# EAGLE design ARK (EAGLE 9.4.2)
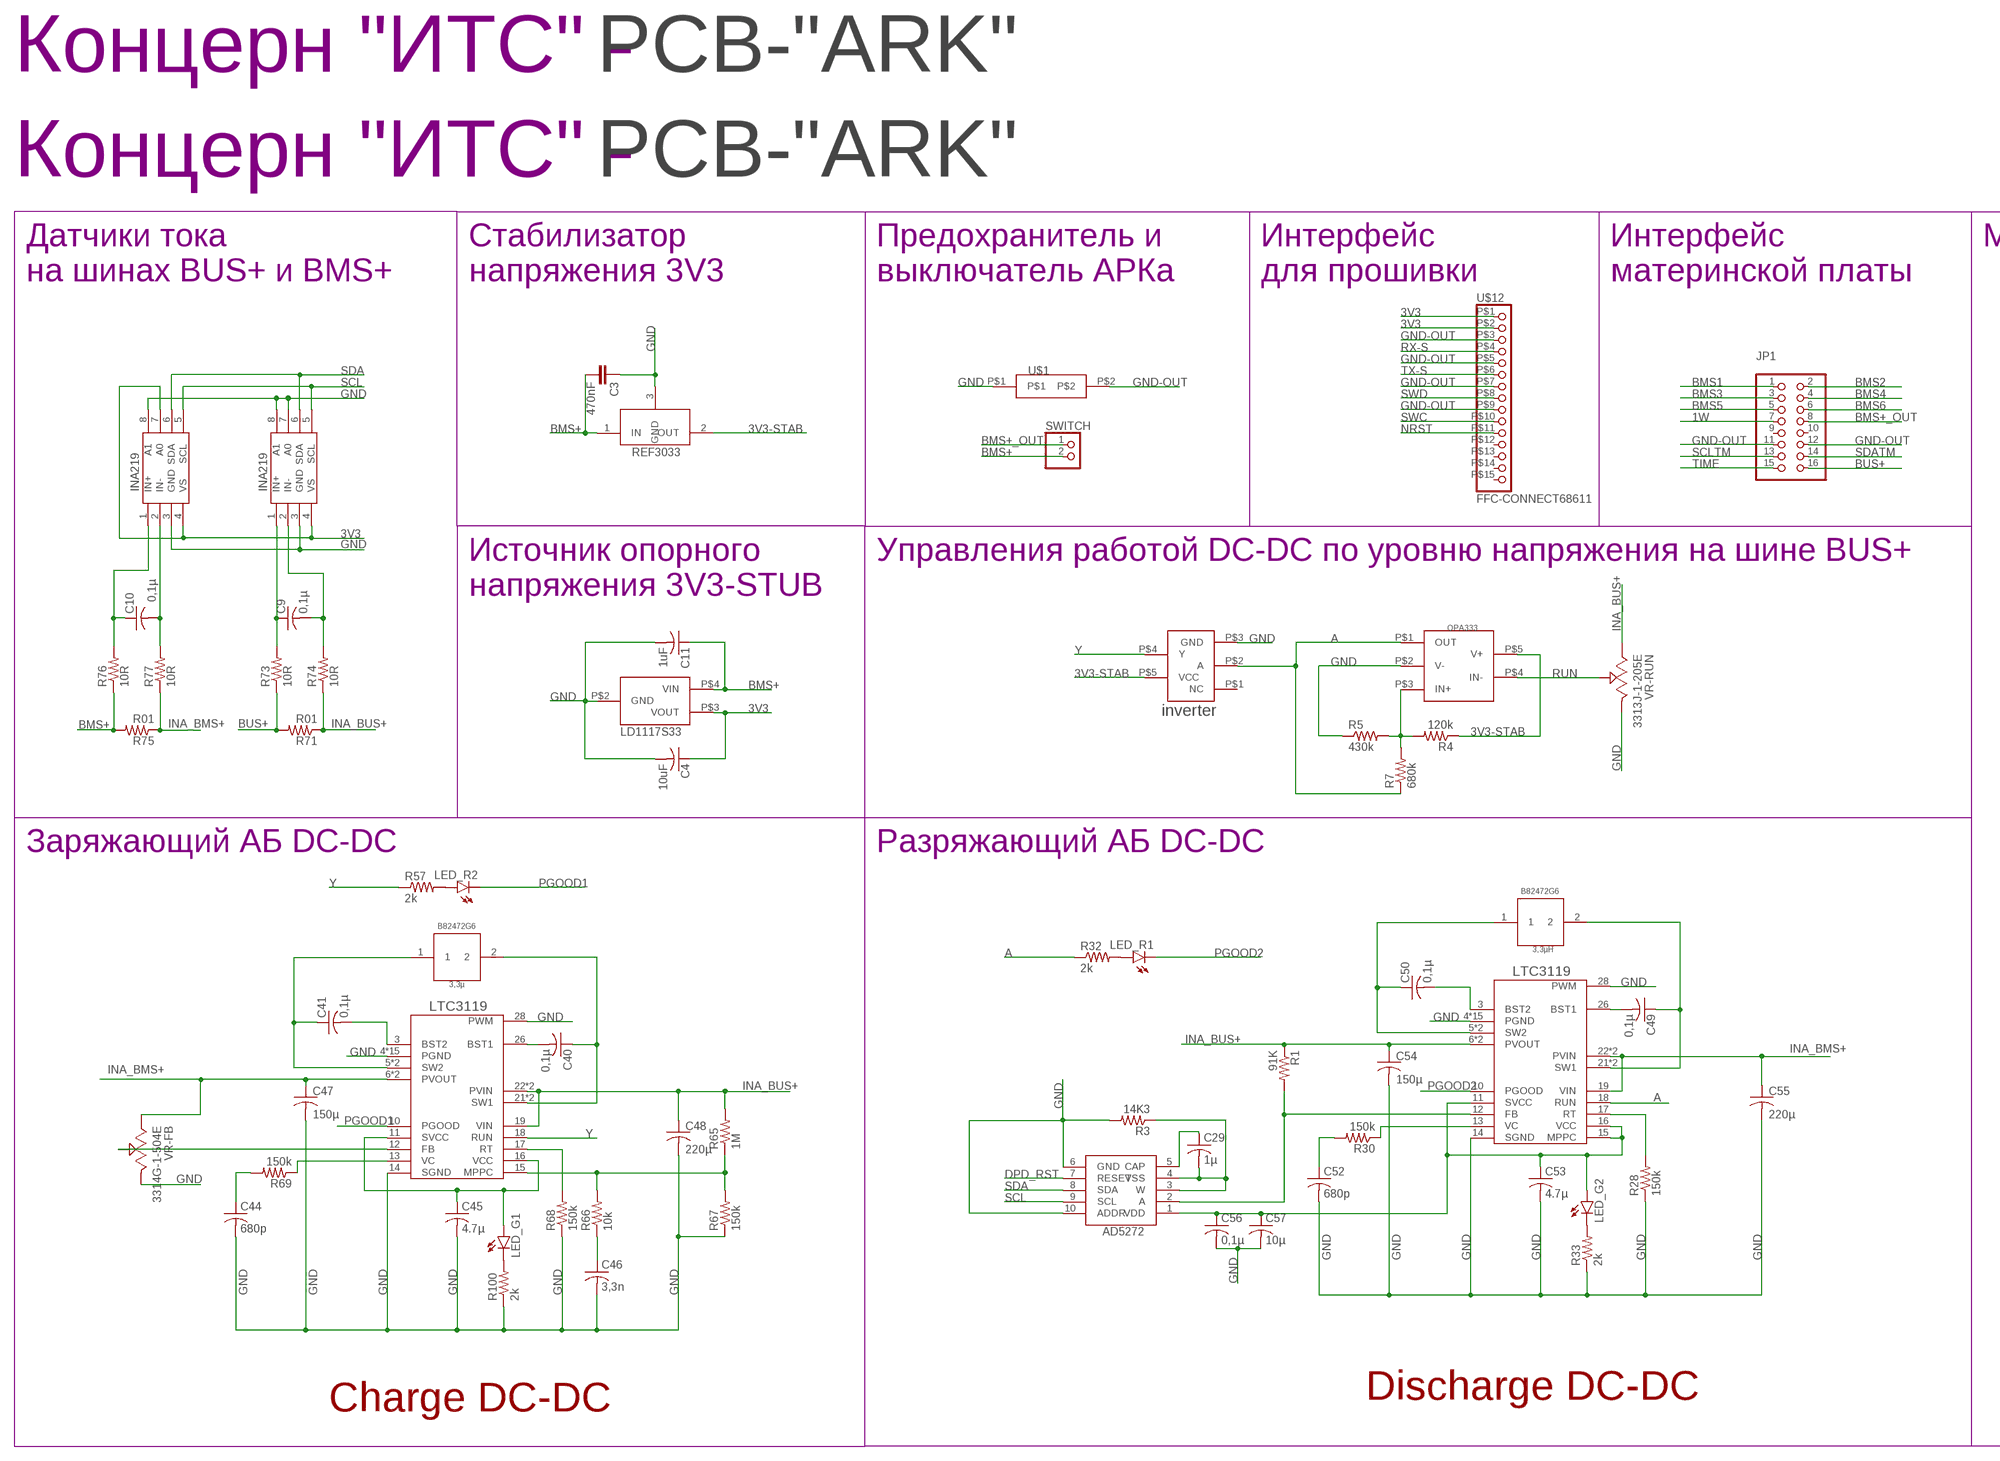
[diagram p0: schematic, sheet 1, part 1 of 2]
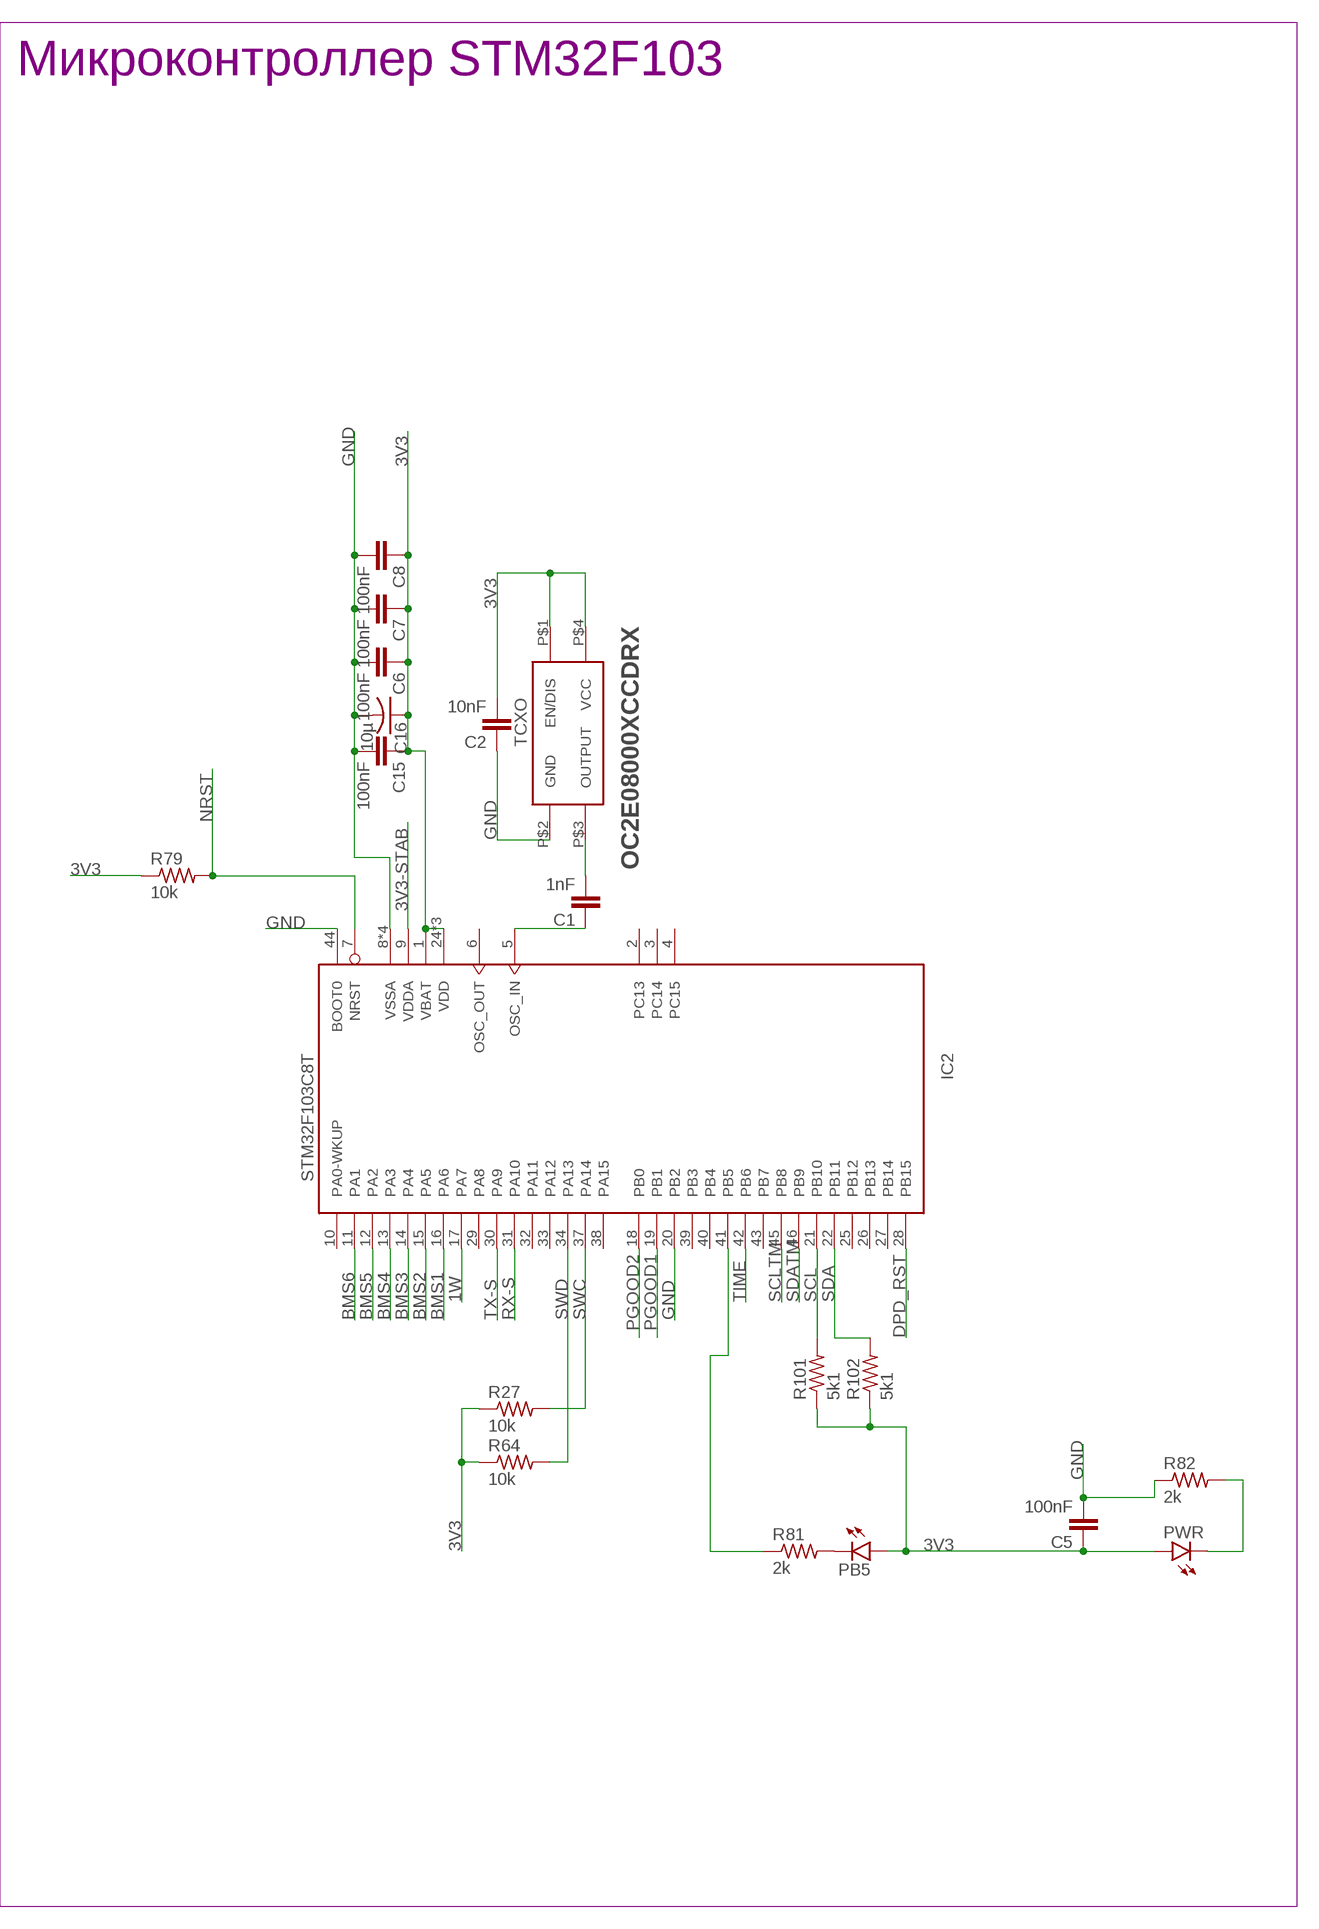
[diagram p1: schematic, sheet 1, part 2 of 2]

## Parts
3,3µH  3,3µ  B82472G6  [B82472G6]
3,3µH1  3,3µH  B82472G6  [B82472G6]
AD5272#2  AD5272  [MSOP10]
C1  1nF  C-EUC0603  [C0603]
C2  10nF  C-EUC0603  [C0603]
C3  470nF  C-EUC0603  [C0603]
C4  10uF  ECAP1UF  [ECAP-SMD-D4]
C5  100nF  C-EUC0603  [C0603]
C6  100nF  C-EUC0603  [C0603]
C7  100nF  C-EUC0603  [C0603]
C8  100nF  C-EUC0603  [C0603]
C9  0,1µ  C-USC0603  [C0603]
C10  0,1µ  C-USC0603  [C0603]
C11  1uF  ECAP1UF  [ECAP-SMD-D4]
C15  100nF  C-EUC0603  [C0603]
C16  10µ  C-USC1206  [C1206]
C29  1µ  C-USC0603  [C0603]
C40  0,1µ  C-USC0603  [C0603]
C41  0,1µ  C-USC0603  [C0603]
C44  680p  C-USC0603  [C0603]
C45  4.7µ  C-USC1206  [C1206]
C46  3,3n  C-USC0603  [C0603]
C47  150µ  ECAPECAP150  [ECAP150-CMD]
C48  220µ  ECAPECAP220  [ECAP220-CMD]
C49  0,1µ  C-USC0603  [C0603]
C50  0,1µ  C-USC0603  [C0603]
C52  680p  C-USC0603  [C0603]
C53  4.7µ  C-USC1206  [C1206]
C54  150µ  ECAPECAP150  [ECAP150-CMD]
C55  220µ  ECAPECAP220  [ECAP220-CMD]
C56  0,1µ  C-USC0603  [C0603]
C57  10µ  C-USC1206  [C1206]
IC2  STM32F103C8T  [LQFP48]
INA219#1  INA219AID  [SOT23-8]
INA219#2  INA219AID  [SOT23-8]
INVERT  INVERTER.  [SC70]
JP1  PINHD-2X8  [2X08]
LD1117S33  LD1117S33  [SOT223]
LED_G1  LEDCHIPLED_0603  [CHIPLED_0603]
LED_G2  LEDCHIPLED_0603  [CHIPLED_0603]
LED_R1  LEDCHIPLED_0603  [CHIPLED_0603]
LED_R2  LEDCHIPLED_0603  [CHIPLED_0603]
OPA  OPA333  [SOT23-5]
PB5  LEDCHIPLED_0603  [CHIPLED_0603]
PWR  LEDCHIPLED_0603  [CHIPLED_0603]
R1  91K  R-US_R0603  [R0603]
R3  14K3  R-US_R0603  [R0603]
R4  120k  R-US_R0603  [R0603]
R5  430k  R-US_R0603  [R0603]
R7  680k  R-US_R0603  [R0603]
R27  10k  R-US_R0603  [R0603]
R28  150k  R-US_R0603  [R0603]
R30  150k  R-US_R0603  [R0603]
R32  2k  R-US_R0603  [R0603]
R33  2k  R-US_R0603  [R0603]
R57  2k  R-US_R0603  [R0603]
R64  10k  R-US_R0603  [R0603]
R65  1M  R-US_R0603  [R0603]
R66  10k  R-US_R0603  [R0603]
R67  150k  R-US_R0603  [R0603]
R68  150k  R-US_R0603  [R0603]
R69  150k  R-US_R0603  [R0603]
R71  R01  R-US_R2512  [R2512]
R73  10R  R-US_R0603  [R0603]
R74  10R  R-US_R0603  [R0603]
R75  R01  R-US_R2512  [R2512]
R76  10R  R-US_R0603  [R0603]
R77  10R  R-US_R0603  [R0603]
R79  10k  R-US_R0603  [R0603]
R81  2k  R-US_R0603  [R0603]
R82  2k  R-US_R0603  [R0603]
R100  2k  R-US_R0603  [R0603]
R101  5k1  R-US_R0603  [R0603]
R102  5k1  R-US_R0603  [R0603]
REF3033  REF3033  [SOT23-3]
SWITCH  PINHD-1X2  [1X02]
TCXO  OC2E08000XCCDRX  [OC2E08000XCCDRX]
U$1  MF-R400  [MF-R400]
U$3  PCB-"ARK"  ITS-LOGOPCB-""  [ITS-LOGO]
U$4  PCB-"ARK"  ITS-LOGOPCB-""  [ITS-LOGO]
U$12  FFC-CONNECT68611  [68611]
U$23  LTC31191  [LTC3119+VIA]
U$59  LTC31191  [LTC3119+VIA]
VR-FB  3314G-1-504E  [TRIM_3314G-1-504E]
VR-RUN  3313J-1-205E  [TRIM_3313J-1-205E]

## Nets
1W: IC2.17(PA7) JP1.7
3V3: C2.2 C4.P+ C5.1 C6.1 C7.1 C8.1 C15.1 C16.1 IC2.1(VBAT) IC2.24(VDD) IC2.36(VDD) IC2.48(VDD) INA219#1.4(VS) INA219#2.4(VS) INA219#2.7(A0) LD1117S33.P$3(VOUT) PB5.A PWR.A R27.1 R64.1 R79.1 R101.1 R102.1 TCXO.P$1(EN/DIS) TCXO.P$4(VCC) U$12.P$1 U$12.P$2
3V3-STAB: IC2.9(VDDA) INVERT.P$5(VCC) OPA.P$5(V+) R4.1 REF3033.2(OUT)
90: R65.1 R66.2 R67.2 U$59.15(MPPC)
A: INVERT.P$2(A) OPA.P$1(OUT) R7.1 R32.1 U$23.18(RUN)
BMS1: IC2.16(PA6) JP1.1
BMS2: IC2.15(PA5) JP1.2
BMS3: IC2.14(PA4) JP1.3
BMS4: IC2.13(PA3) JP1.4
BMS5: IC2.12(PA2) JP1.5
BMS6: IC2.11(PA1) JP1.6
BMS+: C3.2 C11.P+ LD1117S33.P$4(VIN) R75.2 R76.1 REF3033.1(IN) SWITCH.2
BMS+_OUT: JP1.8 SWITCH.1
BUS+: JP1.16 R71.2 R73.1
DPD_RST: AD5272#2.7(RESET) IC2.28(PB15)
GND: AD5272#2.6(GND) AD5272#2.10(ADDR) C2.1 C3.1 C4.P- C5.2 C6.2 C7.2 C8.2 C11.P- C15.2 C16.2 C44.2 C45.2 C46.2 C47.P$2 C48.P$2 C52.2 C53.2 C54.P$2 C55.P$2 C56.2 C57.2 IC2.8(VSSA) IC2.20(PB2) IC2.23(VSSA) IC2.35(VSSA) IC2.44(BOOT0) IC2.47(VSSA) INA219#1.3(GND) INA219#1.7(A0) INA219#1.8(A1) INA219#2.3(GND) INA219#2.8(A1) INVERT.P$3(GND) LD1117S33.P$2(GND) OPA.P$2(V-) R3.2 R5.1 R28.1 R33.1 R67.1 R68.1 R82.1 R100.1 REF3033.3(GND) TCXO.P$2(GND) U$1.P$1 U$23.4(PGND) U$23.9(PGND) U$23.14(SGND) U$23.20(PGND) U$23.25(PGND) U$23.28(PWM) U$23.29(PGND) U$23.P$1(PGND) U$23.P$2(PGND) U$23.P$3(PGND) U$23.P$4(PGND) U$23.P$5(PGND) U$23.P$6(PGND) U$23.P$7(PGND) U$23.P$8(PGND) U$23.P$9(PGND) U$23.P$10(PGND) U$59.4(PGND) U$59.9(PGND) U$59.14(SGND) U$59.20(PGND) U$59.25(PGND) U$59.28(PWM) U$59.29(PGND) U$59.P$1(PGND) U$59.P$2(PGND) U$59.P$3(PGND) U$59.P$4(PGND) U$59.P$5(PGND) U$59.P$6(PGND) U$59.P$7(PGND) U$59.P$8(PGND) U$59.P$9(PGND) U$59.P$10(PGND) VR-FB.3(CW) VR-RUN.3(CW)
GND-OUT: JP1.11 JP1.12 U$1.P$2 U$12.P$3 U$12.P$5 U$12.P$7 U$12.P$9
INA_BMS+: C47.P$1 C55.P$1 R75.1 R77.1 U$23.19(VIN) U$23.22(PVIN) U$23.23(PVIN) U$59.6(PVOUT) U$59.7(PVOUT) VR-FB.1(CCW)
INA_BUS+: C48.P$1 C54.P$1 R1.1 R65.2 R71.1 R74.1 U$23.6(PVOUT) U$23.7(PVOUT) U$59.19(VIN) U$59.22(PVIN) U$59.23(PVIN) VR-RUN.1(CCW)
N$1: C1.1 IC2.5(OSC_IN)
N$2: OPA.P$3(IN+) R4.2 R5.2 R7.2
N$3: AD5272#2.2(A) R1.2 U$23.12(FB)
N$4: C1.2 TCXO.P$3(OUTPUT)
N$14: C9.2 INA219#1.2(IN-) R74.2
N$17: PB5.C R81.2
N$48: AD5272#2.3(W) AD5272#2.4(VSS) C29.2 R3.1
N$51: AD5272#2.5(CAP) C29.1
N$77: 3,3µH1.2 C49.1 U$23.21(SW1) U$23.24(SW1)
N$78: 3,3µH1.1 C50.1 U$23.5(SW2) U$23.8(SW2)
N$79: R28.2 U$23.17(RT)
N$80: C49.2 U$23.26(BST1)
N$81: R30.1 U$23.13(VC)
N$82: C52.1 R30.2
N$84: C50.2 U$23.3(BST2)
N$85: LED_R1.A R32.2
N$87: LED_R2.A R57.2
N$89: U$59.12(FB) VR-FB.2(WIPER)
N$91: LED_G1.C R100.2
N$92: LED_G2.C R33.2
N$129: C41.2 U$59.3(BST2)
N$131: 3,3µH.2 C40.1 U$59.21(SW1) U$59.24(SW1)
N$132: 3,3µH.1 C41.1 U$59.5(SW2) U$59.8(SW2)
N$135: R69.1 U$59.13(VC)
N$136: C44.1 R69.2
N$139: C46.1 R66.1
N$142: R68.2 U$59.17(RT)
N$144: C40.2 U$59.26(BST1)
N$147: C9.1 INA219#1.1(IN+) R73.2
N$150: C10.1 INA219#2.1(IN+) R76.2
N$151: C10.2 INA219#2.2(IN-) R77.2
N$159: PWR.C R82.2
N$161: IC2.41(PB5) R81.1
N$215: AD5272#2.1(VDD) C53.1 C56.1 C57.1 LED_G2.A U$23.11(SVCC) U$23.15(MPPC) U$23.16(VCC)
N$234: C45.1 LED_G1.A U$59.11(SVCC) U$59.16(VCC)
NRST: IC2.7(NRST) R79.2 U$12.P$11
PGOOD1: IC2.19(PB1) LED_R2.C U$59.10(PGOOD)
PGOOD2: IC2.18(PB0) LED_R1.C U$23.10(PGOOD)
RUN: OPA.P$4(IN-) VR-RUN.2(WIPER)
RX-S: IC2.31(PA10) U$12.P$4
SCL: AD5272#2.9(SCL) IC2.21(PB10) INA219#1.5(SCL) INA219#2.5(SCL) R101.2
SCLTM: IC2.45(PB8) JP1.13
SDA: AD5272#2.8(SDA) IC2.22(PB11) INA219#1.6(SDA) INA219#2.6(SDA) R102.2
SDATM: IC2.46(PB9) JP1.14
SWC: IC2.37(PA14) R27.2 U$12.P$10
SWD: IC2.34(PA13) R64.2 U$12.P$8
TIME: IC2.42(PB6) JP1.15
TX-S: IC2.30(PA9) U$12.P$6
Y: INVERT.P$4(Y) R57.1 U$59.18(RUN)
Unconnected: IC2.2(PC13) IC2.3(PC14) IC2.4(PC15) IC2.6(OSC_OUT) IC2.10(PA0-WKUP) IC2.25(PB12) IC2.26(PB13) IC2.27(PB14) IC2.29(PA8) IC2.32(PA11) IC2.33(PA12) IC2.38(PA15) IC2.39(PB3) IC2.40(PB4) IC2.43(PB7) INVERT.P$1(NC) JP1.9 JP1.10 U$12.P$12 U$12.P$13 U$12.P$14 U$12.P$15

## Notes on the sheet
- Датчики тока
  на шинах BUS+ и BMS+
- Стабилизатор
  напряжения 3V3
- Предохранитель и
  выключатель АРКа
- Интерфейс
  для прошивки
- Интерфейс
  материнской платы
- Микроконтроллер STM32F103
- Источник опорного
  напряжения 3V3-STUB
- Управления работой DC-DC по уровню напряжения на шине BUS+
- Заряжающий АБ DC-DC | Разряжающий АБ DC-DC
- Charge DC-DC | Discharge DC-DC

## Library data of the parts
3,3µH 3,3µH1 = CanCubeSat:B82472G6
AD5272#2 = CanCubeSat:AD5272
C1-C3 C5-C8 C15 = rcl:C-EU: CAPACITOR, European symbol; SPICEPREFIX: C
C4 C11 C47 C48 C54 C55 = CanCubeSat:ECAP
C9 C10 C16 C29 C40 C41 C44-C46 C49 C50 C52 C53 C56 C57 = rcl:C-US: CAPACITOR, American symbol; SPICEPREFIX: C
IC2 = CanCubeSat:STM32F103C*T: ARM 32-bit Cortex™-M3 CPU 72 MHz maximum frequency 16 to 128 Kbytes of Flash memory 6 to 20 kbytes of SRAM 37 GPIOs 2.0 to 3.6 V application supply
INA219#1 INA219#2 = CanCubeSat:INA219AID
INVERT = CanCubeSat:INVERTER
JP1 = pinheadCS:PINHD-2X8: PIN HEADER
LD1117S33 = CanCubeSat:LD1117S33
LED_G1 LED_G2 LED_R1 LED_R2 PB5 PWR = led:LED: LED OSRAM: - CHIPLED LG R971, LG N971, LY N971, LG Q971, LY Q971, LO R971, LY R971 LH N974, LH R974 LS Q976, LO Q976, LY Q976 LO Q996 - Hyper CHIPLED LW Q18S LB Q993, LB Q99A, LB R99A - SideLED LS A670, LO A670, LY A670, LG A670, LP A670 LB A673, LV A673, LT A673, LW A673 LH A674 LY A675 LS A676, LA A676, LO A676, LY A676, LW A676 LS A679, LY A679, LG A679 - Hyper Micro SIDELED® LS Y876, LA Y876, LO Y876, LY Y876 LT Y87S - SmartLED LW L88C, LW L88S LB L89C, LB L89S, LG L890 LS L89K, LO L89K, LY L89K LS L896, LA L896, LO L896, LY L896 - TOPLED LS T670, LO T670, LY T670, LG T670, LP T670 LSG T670, LSP T670, LSY T670, LOP T670, LYG T670 LG T671, LOG T671, LSG T671 LB T673, LV T673, LT T673, LW T673 LH T674 LS T676, LA T676, LO T676, LY T676, LB T676, LH T676, LSB T676, LW T676 LB T67C, LV T67C, LT T67C, LS T67K, LO T67K, LY T67K, LW E67C LS E67B, LA E67B, LO E67B, LY E67B, LB E67C, LV E67C, LT E67C LW T67C LS T679, LY T679, LG T679 LS T770, LO T770, LY T770, LG T770, LP T770 LB T773, LV T773, LT T773, LW T773 LH T774 LS E675, LA E675, LY E675, LS T675 LS T776, LA T776, LO T776, LY T776, LB T776 LHGB T686 LT T68C, LB T68C - Hyper Mini TOPLED® LB M676 - Mini TOPLED Santana® LG M470 LS M47K, LO M47K, LY M47K Source: http://www.osram.convergy.de LUXEON: - LUMILED® LXK2-PW12-R00, LXK2-PW12-S00, LXK2-PW14-U00, LXK2-PW14-V00 LXK2-PM12-R00, LXK2-PM12-S00, LXK2-PM14-U00 LXK2-PE12-Q00, LXK2-PE12-R00, LXK2-PE12-S00, LXK2-PE14-T00, LXK2-PE14-U00 LXK2-PB12-K00, LXK2-PB12-L00, LXK2-PB12-M00, LXK2-PB14-N00, LXK2-PB14-P00, LXK2-PB14-Q00 LXK2-PR12-L00, LXK2-PR12-M00, LXK2-PR14-Q00, LXK2-PR14-R00 LXK2-PD12-Q00, LXK2-PD12-R00, LXK2-PD12-S00 LXK2-PH12-R00, LXK2-PH12-S00 LXK2-PL12-P00, LXK2-PL12-Q00, LXK2-PL12-R00 Source: www.luxeon.com KINGBRIGHT: KA-3528ASYC Source: www.kingbright.com
OPA = CanCubeSat:OPA333
R1 R3-R5 R7 R27 R28 R30 R32 R33 R57 R64-R69 R73 R74 R76 R77 R79 R81 R82 R100-R102 = resistor:R-US_: RESISTOR, American symbol
R71 R75 = rcl:R-US_: RESISTOR, American symbol; SPICEPREFIX: R
REF3033 = CanCubeSat:REF3033
SWITCH = pinheadCS:PINHD-1X2: PIN HEADER
TCXO = CanCubeSat:OC2E08000XCCDRX: TCXO OC2E08000XCCDRX 8 MHz
U$1 = CanCubeSat:MF-R400
U$3 U$4 = CanCubeSat:ITS-LOGO
U$12 = CanCubeSat:FFC-CONNECT
U$23 U$59 = CanCubeSat:LTC3119
VR-FB = CanCubeSat:3314G-1-504E
VR-RUN = CanCubeSat:3313J-1-205E: 200 kOhms 0.125W, 1/8W J Lead Surface Mount Trimmer Potentiometer Cermet 1 Turn Top Adjustment Check prices <https://pricing.snapeda.com/parts/3313J-1-104E/Bourns/view-part?ref=eda>; AVAILABILITY: Good; DESCRIPTION: 100 kOhms 0.125W, 1/8W J Lead Surface Mount Trimmer Potentiometer Cermet 1 Turn Top Adjustment; MF: Bourns; MP: 3313J-1-104E; PACKAGE: 5025 Bourns; PRICE: None; PURCHASE-URL: https://pricing.snapeda.com/search/part/3313J-1-104E/?ref=eda

## Board
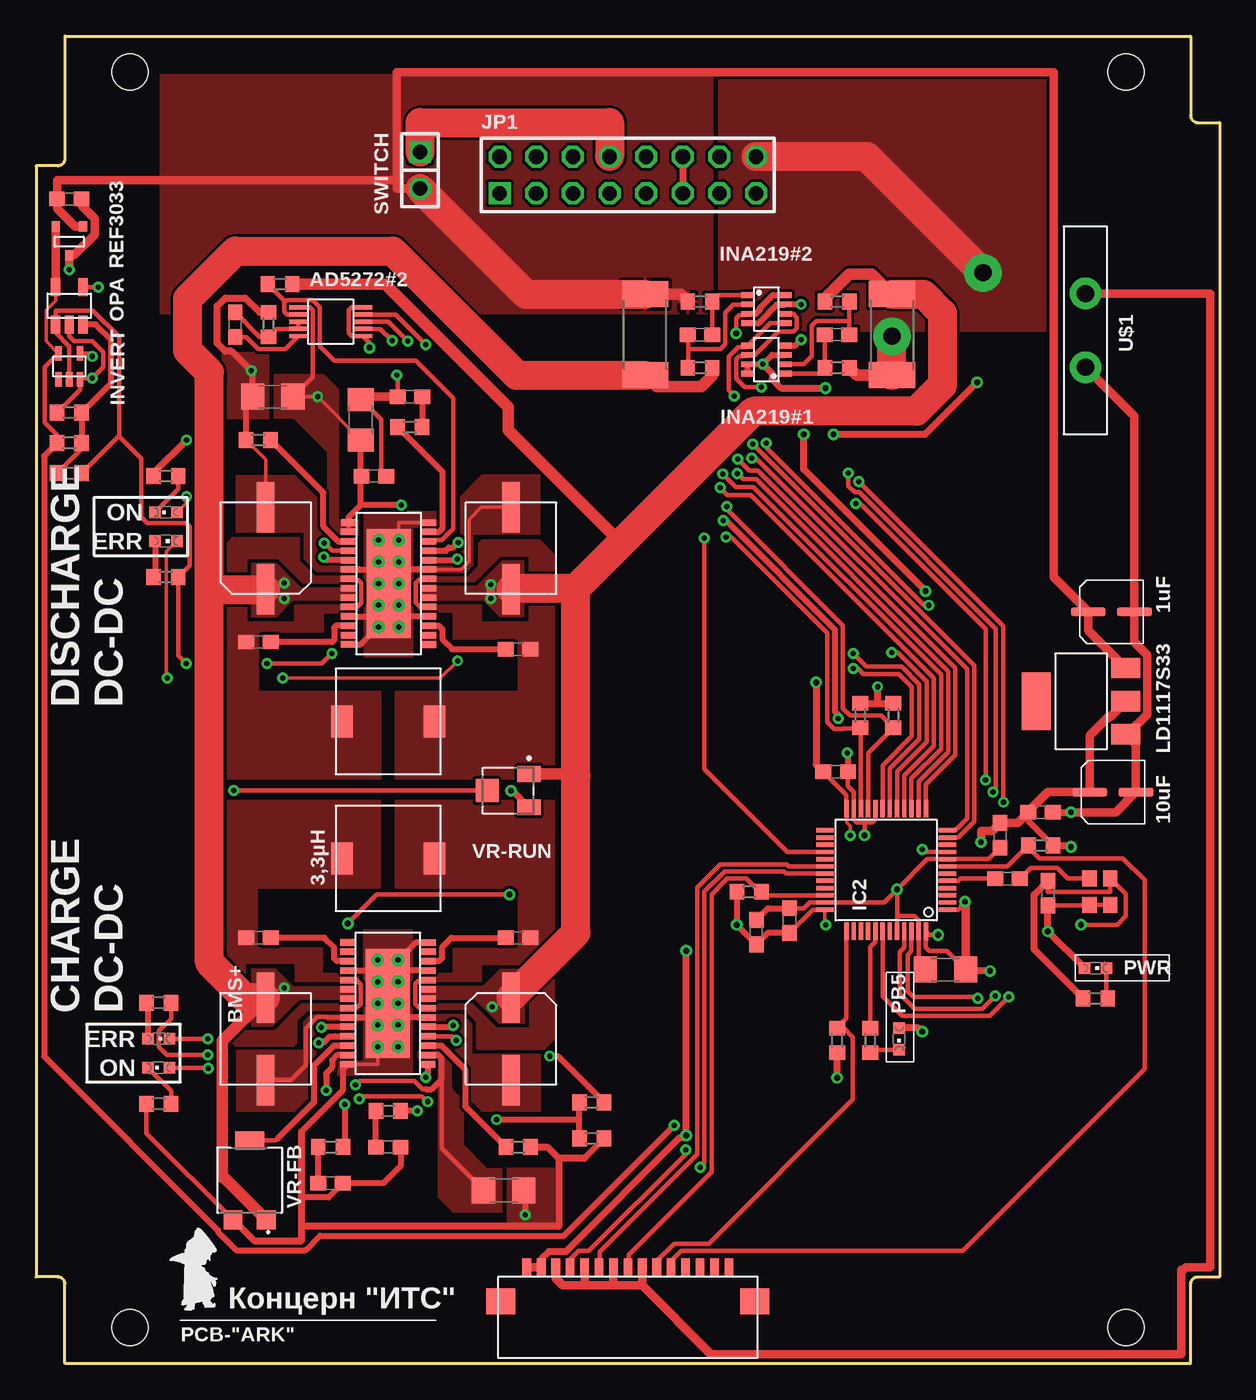
[diagram p2: board, top side]
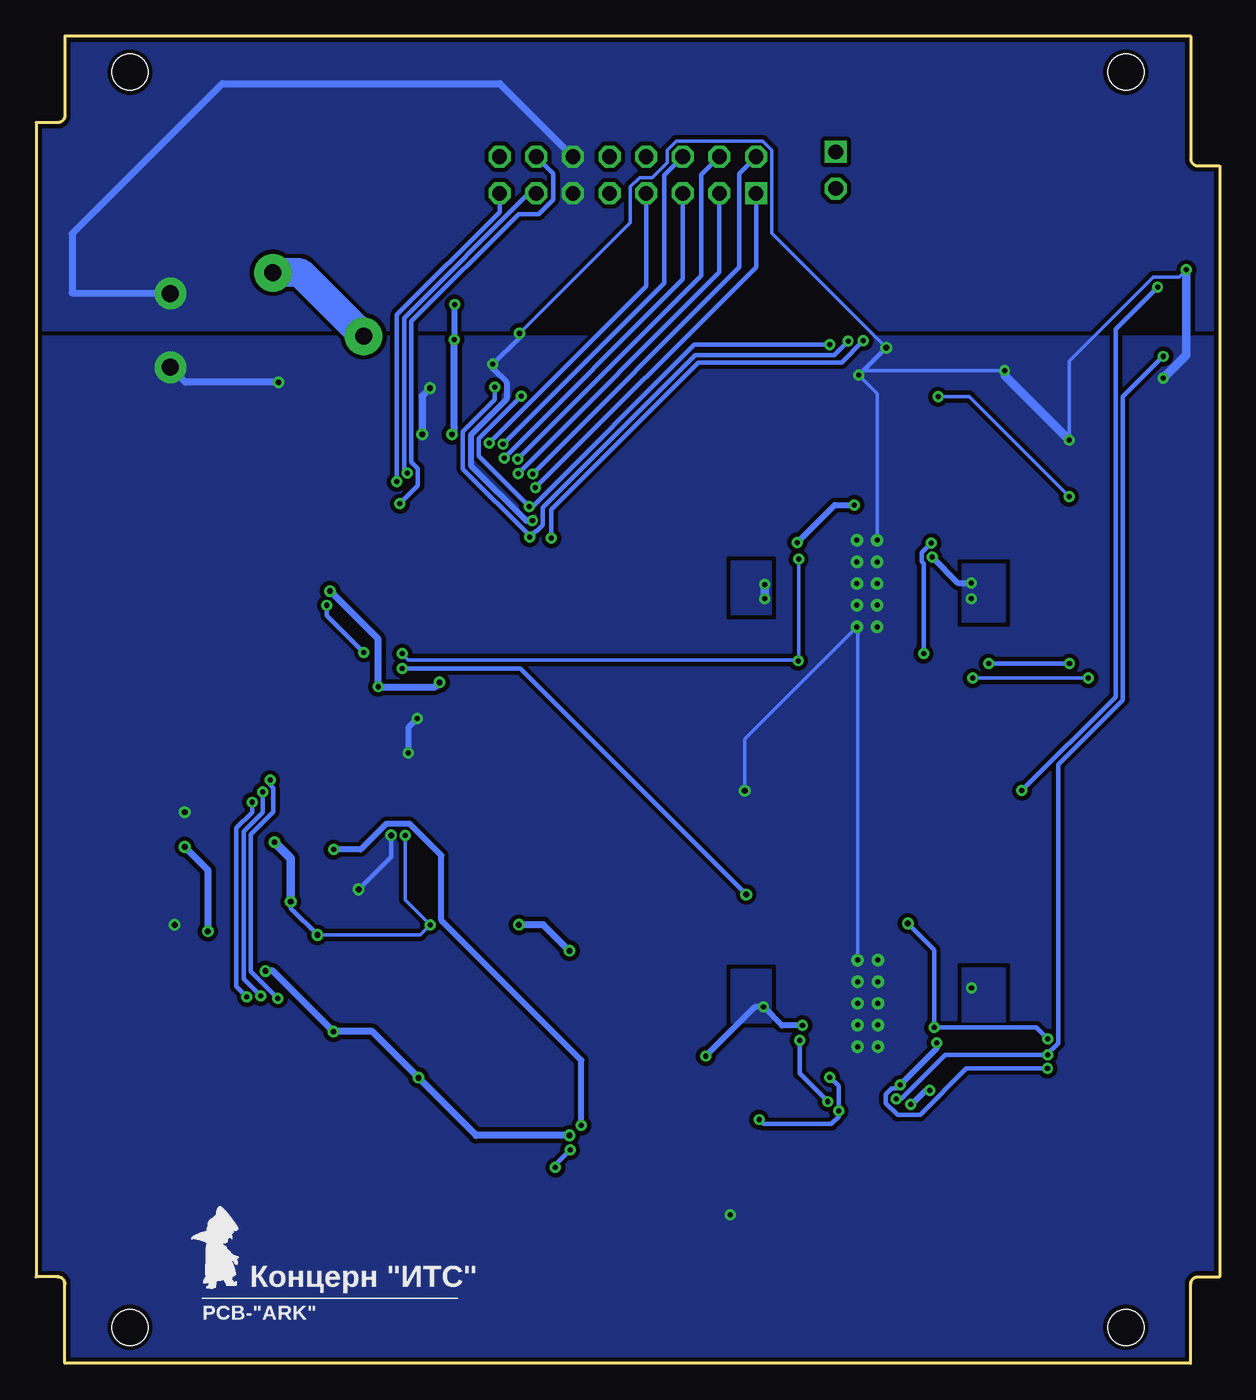
[diagram p3: board, bottom side, seen from below]

Size 82 x 92 mm. Coordinates in mm from the lower left corner, seen from the top.
Outline: 2,92 80,92 80,86.5 arc90 80.5,86 82,86 82,6 80.5,6 arc90 80,5.5 80,0 2,0 2,5.5 arc90 1.5,6 0,6 0,83 1.5,83 arc90 2,83.5 2,92
Copper layers (1*16): Top 0.035mm / dielectric 1.5mm / Bottom 0.035mm
Design rules "default *": minimum track width 0.25mm, minimum drill 0.35mm, track to track 0.2mm, track to pad 0.2mm, pad to pad 0.2mm, via to via 0.2mm, smd to smd 0.2mm, copper to edge 0.25mm, drill to drill 0.2mm, minimum pad ring 10mil, minimum via ring 8mil, stop-mask expansion 4mil, vias tented up to drill 0mil, thermal gap 10mil
Holes 2.5 mm at 6.5,2.5 75.5,2.5 75.5,89.5 6.5,89.5

### Footprints (pad centres in the part's own frame; a part is rotated, then mirrored left to right if it is on the bottom)
B82472G6 = smd 1.5 x 2.2: 1 -3.2,0; 2 3.2,0
MSOP10 = smd 0.3 x 1.275: 1 -1,-2.24; 2 -0.5,-2.24; 3 0,-2.24; 4 0.5,-2.24; 5 1,-2.24; 6 1,2.24; 7 0.5,2.24; 8 0,2.24; 9 -0.5,2.24; 10 -1,2.24
C0603 = smd 1.1 x 1: 1 -0.85,0; 2 0.85,0
ECAP-SMD-D4 = smd 0.6 x 2.4: P+ 0,1.6; P- 0,-1.6
C1206 = smd 1.6 x 1.8: 1 -1.4,0; 2 1.4,0
ECAP150-CMD = smd 1.2 x 3.5: P$1 0,2.85; P$2 0,-2.85
ECAP220-CMD = smd 1.2 x 3.5: P$1 0,2.85; P$2 0,-2.85
LQFP48 = smd 0.3 x 1.2: 1 -2.75,-4.25; 2 -2.25,-4.25; 3 -1.75,-4.25; 4 -1.25,-4.25; 5 -0.75,-4.25; 6 -0.25,-4.25; 7 0.25,-4.25; 8 0.75,-4.25; 9 1.25,-4.25; 10 1.75,-4.25; 11 2.25,-4.25; 12 2.75,-4.25; 25 2.75,4.25; 26 2.25,4.25; 27 1.75,4.25; 28 1.25,4.25; 29 0.75,4.25; 30 0.25,4.25; 31 -0.25,4.25; 32 -0.75,4.25; 33 -1.25,4.25; 34 -1.75,4.25; 35 -2.25,4.25; 36 -2.75,4.25 | smd 1.2 x 0.3: 13 4.25,-2.75; 14 4.25,-2.25; 15 4.25,-1.75; 16 4.25,-1.25; 17 4.25,-0.75; 18 4.25,-0.25; 19 4.25,0.25; 20 4.25,0.75; 21 4.25,1.25; 22 4.25,1.75; 23 4.25,2.25; 24 4.25,2.75; 37 -4.25,2.75; 38 -4.25,2.25; 39 -4.25,1.75; 40 -4.25,1.25; 41 -4.25,0.75; 42 -4.25,0.25; 43 -4.25,-0.25; 44 -4.25,-0.75; 45 -4.25,-1.25; 46 -4.25,-1.75; 47 -4.25,-2.25; 48 -4.25,-2.75
SOT23-8 = smd 0.9 x 0.4: 1 -1.3,0.975; 2 -1.3,0.325; 3 -1.3,-0.325; 4 -1.3,-0.975; 5 1.3,-0.975; 6 1.3,-0.325; 7 1.3,0.325; 8 1.3,0.975
SC70 = smd 0.47 x 1: P$1 -0.75,-0.9; P$2 0,-0.9; P$3 0.75,-0.9; P$4 0.75,0.9; P$5 -0.75,0.9
2X08 = drill 1.016 square: 1 -8.89,-1.27 | drill 1.016 octagon: 2 -8.89,1.27; 3 -6.35,-1.27; 4 -6.35,1.27; 5 -3.81,-1.27; 6 -3.81,1.27; 7 -1.27,-1.27; 8 -1.27,1.27; 9 1.27,-1.27; 10 1.27,1.27; 11 3.81,-1.27; 12 3.81,1.27; 13 6.35,-1.27; 14 6.35,1.27; 15 8.89,-1.27; 16 8.89,1.27
SOT223 = smd 4 x 2: P$1 0,3.1 | smd 1.4 x 2: P$2 -2.29,-3.1; P$3 0,-3.1; P$4 2.29,-3.1
CHIPLED_0603 = smd 0.8 x 0.8: A 0,-0.75; C 0,0.75
SOT23-5 = smd 0.635 x 1.27: P$1 -0.95,-1.3; P$2 0,-1.3; P$3 0.95,-1.3; P$4 0.95,1.3; P$5 -0.95,1.3
R0603 = smd 1 x 1.1: 1 -0.85,0; 2 0.85,0
R2512 = smd 1.8 x 3.2: 1 -2.8,0; 2 2.8,0
SOT23-3 = smd 0.56 x 0.73: 1 -0.95,-1; 2 0.95,-1; 3 0,1
1X02 = drill 1.016 square: 1 -1.27,0 | drill 1.016 octagon: 2 1.27,0
OC2E08000XCCDRX = smd 1.1 x 1: P$1 0.925,0.725; P$2 -0.925,0.725; P$3 -0.925,-0.725; P$4 0.925,-0.725
MF-R400 = drill 1.2 pad 2.184: P$1 0,2.55; P$2 0,-2.55
68611 = smd 0.6 x 1.3: P$1 -7,0.65; P$2 -6,0.65; P$3 -5,0.65; P$4 -4,0.65; P$5 -3,0.65; P$6 -2,0.65; P$7 -1,0.65; P$8 0,0.65; P$9 1,0.65; P$10 2,0.65; P$11 3,0.65; P$12 4,0.65; P$13 5,0.65; P$14 6,0.65; P$15 7,0.65 | smd 2 x 1.8: P$16 8.8,-1.7; P$17 -8.8,-1.7
LTC3119+VIA = smd 0.45 x 1.05: 1 -4.225,-2.775; 2 -3.575,-2.775; 3 -2.925,-2.775; 4 -2.275,-2.775; 5 -1.625,-2.775; 6 -0.975,-2.775; 7 -0.325,-2.775; 8 0.325,-2.775; 9 0.975,-2.775; 10 1.625,-2.775; 11 2.275,-2.775; 12 2.925,-2.775; 13 3.575,-2.775; 14 4.225,-2.775; 15 4.225,2.775; 16 3.575,2.775; 17 2.925,2.775; 18 2.275,2.775; 19 1.625,2.775; 20 0.975,2.775; 21 0.325,2.775; 22 -0.325,2.775; 23 -0.975,2.775; 24 -1.625,2.775; 25 -2.275,2.775; 26 -2.925,2.775; 27 -3.575,2.775; 28 -4.225,2.775 | smd 7.56 x 3.05: 29 0,0 | drill 0.35 pad 0.813: P$1 -3,0.7; P$2 -1.5,0.7; P$3 0,0.7; P$4 1.5,0.7; P$5 3,0.7; P$6 3,-0.7; P$7 1.5,-0.7; P$8 0,-0.7; P$9 -1.5,-0.7; P$10 -3,-0.7
TRIM_3314G-1-504E = smd 1.3 x 1.3: 1 1.15,-2.75; 3 -1.15,-2.75 | smd 2 x 1.3: 2 0,2.75
TRIM_3313J-1-205E = smd 1.1 x 1.6: 1 1.15,-1.45; 3 -1.15,-1.45 | smd 1.6 x 1.6: 2 0,1.45

### Placement (x,y rotation side)
3,3µH  24.4,35 0 top
3,3µH1  24.4,44.5 180 top
AD5272#2  20.41,72.2 270 top
C1  67.3,33.6 0 top
C2  70.1,32.6 270 top
C3  2.3,80.7 180 top
C4  74.6,39.6 90 top
C5  49.9,29.9 90 top
C6  66.8,36.6 270 top
C7  55.4,41 0 top
C8  52.2,30.7 90 top
C9  55.5,71.3 0 top
C10  46,71.3 180 top
C11  74.5,52.1 90 top
C15  69.6,38.2 0 top
C16  63,27.3 180 top
C29  13.8,72 90 top
C40  33.4,29.5 180 top
C41  15.4,29.5 0 top
C44  20.4,12.5 0 top
C45  32.4,12 0 top
C46  24.4,15 0 top
C47  15.9,22.5 0 top
C48  32.9,22.5 0 top
C49  15.4,50 0 top
C50  33.4,49.5 180 top
C52  25.9,67 180 top
C53  16.4,67 180 top
C54  32.9,56.5 180 top
C55  15.9,56.5 180 top
C56  23.4,61.5 0 top
C57  22.5,65.4 90 top
IC2  58.9,34.2 90 top
INA219#1  50.6,69.58 180 top
INA219#2  50.6,73.08 0 top
INVERT  2.3,69.1 0 top
JP1  41,82.37 0 top
LD1117S33  72.4,45.9 90 top
LED_G1  8.5,20.5 90 top
LED_G2  9,59 90 top
LED_R1  9,57 270 top
LED_R2  8.5,22.5 270 top
OPA  2.3,73.3 0 top
PB5  59.8,22.5 180 top
PWR  73.4,27.4 270 top
R1  16.9,74.8 180 top
R3  16.1,72 90 top
R4  2.3,63.8 0 top
R5  2.3,65.9 0 top
R7  2.3,61.7 180 top
R27  55.5,22.4 90 top
R28  15.4,64 0 top
R30  25.9,64.9 0 top
R32  9,54.5 180 top
R33  9,61.5 0 top
R57  8.5,25 180 top
R64  49.4,32.7 0 top
R65  38.5,18.1 0 top
R66  24.4,17.5 0 top
R67  38.5,15.6 180 top
R68  33.4,15 180 top
R69  20.4,15 180 top
R71  59.3,71.3 270 top
R73  55.5,69 180 top
R74  55.5,73.6 0 top
R75  42.2,71.3 90 top
R76  46,73.6 0 top
R77  46,69 180 top
R79  69.6,35.9 180 top
R81  57.8,22.4 270 top
R82  73.4,25.3 0 top
R100  8.5,18 0 top
R101  59.4,44.9 270 top
R102  57.1,44.9 270 top
REF3033  2.3,77.8 180 top
SWITCH  26.6,82.7 270 top
TCXO  73.7,32.7 270 top
U$1  72.7,71.6 180 top
U$3  10,3 0 top
U$4  70.5,4.5 0 bottom
U$12  41,6 0 top
U$23  24.43,54.05 90 top
U$59  24.38,24.95 270 top
VR-FB  14.8,12.7 0 top
VR-RUN  32.7,39.7 90 top

### Tracks (layer width: path | path; a pad name or v marks a point on that pad's centre or on a via)
1W  (via drill 0.35)
  Top 0.3: IC2.17 59.65,41.04 61.7,43.09 61.7,47.27 59.69,49.28 v59.28,49.28 | v61.85,52.55 61.55,52.55 50.6,63.49 v50.6,63.79
  Bottom 0.3: v61.85,52.55 61.85,51.85 v59.28,49.28 | JP1.7 39.73,74.66 39.75,74.65 v50.6,63.79
3V3  (via drill 0.35, 0.4)
  Top 0.25: v54.7,30.4 54.65,30.45 IC2.36 | IC2.24 56.17,38.42 56.17,37.51 56.42,37.27 v56.42,36.6 | U$12.P$2 35.05,6.7
  Top 0.3: C16.1 63.1,28.6 61.9,28.6 61.65,28.85 IC2.48 61.9,29.7 v62.5,29.7 | C7.1 56.15,39.4 IC2.24 | v64.35,32 64.1,31.75 64.1,31.66 63.9,31.45 IC2.1 | C8.1 53.8,31.45 IC2.36 | C2.2 72.97,31.75 TCXO.P$4 TCXO.P$1
  Top 0.4: INA219#2.4 50.06,72.1 50.75,72.79 50.75,72.82 51.33,73.4 INA219#2.7 v53,73.4 | INA219#1.4 52.6,70.55 v53.02,70.97 | C8.1 50.7,29.85 C5.1 v48.55,30.4 R64.1 | C15.1 68.75,37.6 R79.1
  Top 0.5: 35.05,6.7 35.05,7.29 35.51,7.75 36.71,7.75 44.61,15.65 44.89,15.65 v45.05,15.81 v45.05,28.6 | v55.5,19.8 R27.1 | v61.4,23 61.15,23.25 PB5.A | v66.1,27.2 64.5,27.2 C16.1 | R102.1 58.3,45.75 | 58.3,45.75 R101.1 | 58.3,45.75 v58.3,46.9 | v61.63,53.53 53.19,61.97 v53.19,64.4 | v54.05,47.2 54.05,41.5 C7.1 | PWR.A v70.1,29.95 C2.2 | R79.1 71.6,35.9 v71.7,35.8
  Top 0.6: LD1117S33.P$3 74.41,44.81 74.29,44.81 73,43.52 C4.P+ 70.09,39.6 68.75,38.26 C15.1 68,37.45 C6.1 66.25,36.91 65.47,36.91 v65.47,36.12 | U$12.P$2 U$12.P$1 | C16.1 64.4,31.95 v64.35,32
  Bottom 0.25: v62.5,29.7 55.4,29.7 v54.7,30.4 56.42,32.12 v56.42,36.6
  Bottom 0.3: v62.5,29.7 64.35,31.55 v64.35,32 | 65.42,36.08 v65.47,36.12
  Bottom 0.4: v53,73.4 53.02,73.4 v53.02,70.97
  Bottom 0.5: v45.05,15.81 51.51,15.81 v55.5,19.8 58.7,23 v61.4,23 65.6,27.2 v66.1,27.2 | v61.63,53.53 58.3,50.2 v58.3,46.9 54.35,46.9 v54.05,47.2 | v53.19,64.4 53.03,64.55 53.03,64.84 53.02,64.85 v53.02,70.97 | v45.05,28.6 46.85,30.4 v48.55,30.4 | v71.7,35.8 70.1,34.2 v70.1,29.95
  Bottom 0.6: v64.35,32 64.35,35 65.42,36.08
3V3-STAB  (via drill 0.35)
  Top 0.25: OPA.P$5 1.35,73.66 0.71,73.01 0.71,70.84 INVERT.P$5
  Top 0.3: R4.1 1.45,64.36 0.6,65.2 0.6,69.05 INVERT.P$5 | v61.38,35.62 61.55,35.45 IC2.9
  Top 0.4: R4.1 0.55,62.9 0.55,21.29 12.6,9.24 12.6,9.13 13.88,7.85 18.67,7.85 19.67,8.85 36.57,8.85 v44.22,16.5
  Top 0.6: REF3033.2 OPA.P$5
  Bottom 0.4: v61.38,35.62 59.52,35.62 57.73,37.4 56.12,37.4 53.92,35.2 53.92,30.72 44.22,21.02 v44.22,16.5
90  (via drill 0.35, 0.35 pad 0.7)
  Top 0.4: U$59.15 27.15,19.98 v27,19.83 | v26.4,17.5 R66.2 | R67.2 37.65,16.9 | 37.65,16.9 R65.1 | 37.65,16.9 v31.9,16.9
  Bottom 0.3: v27,19.83 26.4,19.23 v26.4,17.5 26.4,17.1 26.9,16.6 31.6,16.6 v31.9,16.9
A  (via drill 0.35)
  Top 0.3: v10.4,48.5 9.85,49.05 R32.1 10.65,55.3 10.65,58 10.4,58.25 7.71,58.25 7.3,58.66 7.3,62.7 5.72,64.28 | v16,48.5 19.8,48.5 v20.5,49.2 | v19.96,56.85 19.99,56.85 20.51,56.33 U$23.18 | INVERT.P$2 2.3,70.48 1.35,71.43 OPA.P$1 1.35,72.98 3.94,72.98 5.75,71.18 5.75,64.3 5.72,64.28 | R7.1 5.72,64.28
  Bottom 0.3: v10.4,48.5 v16,48.5 | v19.96,56.85 19.99,56.85 20.65,56.19 20.65,55.59 20.5,55.44 v20.5,49.2
BMS1  (via drill 0.35)
  Top 0.3: IC2.16 60.15,40.75 62.2,42.8 62.2,47.5 49.5,60.2 47.9,60.2 v47.4,60.7
  Bottom 0.3: v47.4,60.7 32.11,75.99 JP1.1
BMS2  (via drill 0.35)
  Top 0.3: IC2.15 60.65,40.54 62.7,42.59 62.7,47.74 49.69,60.76 48.49,60.76 v47.59,61.66
  Bottom 0.3: v47.59,61.66 33.27,75.97 33.27,82.48 JP1.2
BMS3  (via drill 0.35)
  Top 0.3: IC2.14 61.15,40.34 63.2,42.39 63.2,47.98 49.89,61.29 48.99,61.29 v48.59,61.69
  Bottom 0.3: v48.59,61.69 34.65,75.62 JP1.3
BMS4  (via drill 0.35)
  Top 0.3: IC2.13 61.65,40.13 63.7,42.18 63.7,48.2 50.02,61.89 49.42,61.89 v48.62,62.69
  Bottom 0.3: v48.62,62.69 35.9,75.4 35.9,82.39 JP1.4
BMS5  (via drill 0.35)
  Top 0.3: IC2.12 63.69,36.95 64.5,37.76 64.5,48.13 49.88,62.76 v49.58,62.76
  Bottom 0.3: v49.58,62.76 37.19,75.14 JP1.5
BMS6  (via drill 0.35)
  Top 0.3: IC2.11 63.9,36.45 65,37.55 65,48.36 v49.65,63.72
  Bottom 0.3: v49.65,63.72 38.48,74.88 38.48,82.35 JP1.6
BMS+
  Top 0.6: REF3033.1 2.7,78.8 1.45,80.05 C3.2 1.45,82 25,82 | LD1117S33.P$4 72.9,50.79 C11.P+ 70.5,54.5 70.5,89.5 25,89.5 25,82 | SWITCH.2 25,81.43 25,82
  Top 0.8: R75.2 44.65,74.1 R76.1
  Top 2: SWITCH.2 33.93,74.1 R75.2
  pour Top: 8.6,89.3 8.6,72.8 46.9,72.8 46.9,89.3
BMS+_OUT
  Top 2: SWITCH.1 26.6,86 39.73,86 JP1.8
BUS+  (via drill 1.2 pad 2.6)
  Top 0.8: R73.1 56.85,68.5 R71.2
  Top 2: R71.2 v59.3,71.2 | v65.6,75.6 57.56,83.64 JP1.16
  Bottom 2: v59.3,71.2 63.7,75.6 v65.6,75.6
  pour Top (no thermals): 47.3,89.3 47.3,71.6 70,71.6 70,89.3
DPD_RST  (via drill 0.35)
  Top 0.3: IC2.28 52.05,35.45 46.3,41.2 v46.3,57.2 | AD5272#2.7 23.86,71.7 v24.68,70.88
  Bottom 0.3: v24.68,70.88 26.18,69.38 36.11,69.38 46.3,59.19 v46.3,57.2
GND  (via drill 0.35, 0.35 pad 0.7, 0.4)
  Top 0.25: U$23.9 29.46,55.04 30,55.58 30,58.5 30.85,59.35 C54.P$2 | R28.1 15.9,62.65 C55.P$2 | U$59.14 23.68,20.73 U$59.P$6 | U$23.14 25.12,58.28 U$23.P$6 | U$23.29 24.43,55.55 U$23.P$7
  Top 0.3: C16.2 61.15,27.75 IC2.47 61.15,30.7 60.84,31 59.65,31 | IC2.44 59.65,31 | 59.65,31 v59.65,32.85 | v59.65,32.85 61.75,34.95 IC2.8 66,34.95 C6.2 | C8.2 53.19,31.55 53.59,31.95 IC2.35 58.75,31.95 v59.65,32.85 | C7.2 56.25,40.01 56.65,39.61 IC2.23 56.65,37.7 56.85,37.5 57.4,37.5 | IC2.20 58.15,37.7 57.95,37.5 57.4,37.5 | AD5272#2.10 21.87,73.2 21.66,73 21.66,71.41 21.87,71.2 AD5272#2.6 23.1,70.75 v23.1,70.4 | v57.4,36.6 57.4,37.5 | INA219#2.3 49.2,72.65 48.7,72.65 48.5,72.44 48.5,71.75 v48.5,71.39 | R5.1 3.05,67.5 INVERT.P$3 3.15,68.3 v3.9,68.3 4.65,69.05 4.65,70.08 3.88,70.85 2.64,70.85 2.3,71.19 OPA.P$2 | C52.2 25.05,68.45 v25,68.5 | C57.2 23.9,65.4 23.9,61.85 C56.2 | VR-FB.3 7.65,15.95 R100.1 | C47.P$2 17.67,19.65 18.69,20.67 18.69,23.23 19.47,24.02 20.07,24.02 20.11,23.98 22,23.98 | C2.1 70.1,32.67 74.42,32.67 TCXO.P$2 75.5,32.55 75.5,31 74.9,30.4 v72.4,30.4
  Top 0.4: U$59.14 21.24,20.38 21.24,18.91 18.4,16.07 | C45.2 33.9,11.9 v33.9,10.3 | C53.2 15,67.2 | 15,67.2 15,68.7 v14.9,68.8 | U$59.4 22.95,27.23 U$59.P$10 | U$59.25 25.8,27.23 U$59.P$1 26.3,29.18 U$59.28 | U$23.25 23,51.78 U$23.P$1 22.5,49.83 U$23.28 | U$23.4 25.85,51.78 U$23.P$10 | U$23.9 25.65,55.03 U$23.P$7 | U$23.20 23.2,55.03 U$23.P$4 | U$59.9 22,23.98 23.15,23.98 U$59.P$7 | U$59.20 25.6,23.98 U$59.P$4 | C46.2 25.25,13.7 24.05,12.5 C44.2 20.25,11.5 18.4,11.5 | R67.1 38.05,14.3 | R28.1 14.55,66.75 15,67.2 | INA219#1.3 51,69.9 v50.35,69.25 INA219#1.7 INA219#1.8 | INA219#2.3 49.87,72.75 50.15,73.03 50.15,73.15 51.05,74.05 INA219#2.8 | C5.2 50.7,31.55 C8.2 | v47.61,58.41 47.81,58.41 55.35,50.86 55.35,45.18 55.59,44.94 v55.59,44.69 | v56.2,42.3 56.25,42.25 C7.2
  Top 0.5: R68.1 35.4,15 36.2,14.2 | 36.2,14.2 36.2,9.5 18.4,9.5 | 18.4,9.5 18.4,8.5 15.1,8.5 VR-FB.3 | 18.4,9.5 18.4,11.5 18.4,16.07 | VR-RUN.3 33,39.7 v32.9,39.7 | v14.9,68.8 13.55,70.15 13.11,70.15 12.55,70.71 12.55,73.29 13.11,73.85 14.49,73.85 15.49,72.85 R3.2 | v50.35,69.25 51,68.6 51,68.21 51.61,67.6 v54.7,67.6 | v55.25,64.4 61.6,64.4 v65.2,68 | C2.1 70.1,33.44 69.15,32.49 69.15,28.7 R82.1 | C15.2 v71.7,38.2 | 38.05,14.3 37.95,14.2 36.2,14.2 | v10.42,64 8.15,61.73 R33.1
  Top 0.6: C3.1 3.15,80.25 4.05,79.35 4.05,78.25 2.6,76.8 REF3033.3 v2.3,75.8 | C52.2 22.7,67 C57.2 | U$1.P$1 76.1,65.65 C11.P- 76.1,50 77,49.1 77,44.99 75.62,43.61 LD1117S33.P$2 76.2,42.91 C4.P- 74.8,38.2 v71.7,38.2
  Bottom 0.25: v32.9,39.7 32.9,43.28 U$23.P$10 25.07,51.01 U$59.P$1 | U$23.P$5 23.73,67.22 v25,68.5 24.7,68.8 v14.9,68.8 | v48.5,71.39 40.82,79.08 40.82,81.55 40.18,82.19 39.31,82.19 38.28,83.22 38.28,84.09 37.64,84.73 31.66,84.73 31.02,84.09 31.02,78.32 v23.1,70.4 | v2.3,75.8 2.8,75.3 4.59,75.3 10.42,69.47 v10.42,64
  Bottom 0.3: v59.65,32.85 57.4,35.1 v57.4,36.6 | v50.35,69.25 48.5,71.1 v48.5,71.39 | v23.1,70.4 v25,68.5
  Bottom 0.4: v50.35,69.25 50.35,68.95 49.4,68 49.4,66.82 51.88,64.34 51.88,62.24 48.05,58.41 v47.61,58.41 | v55.59,44.69 56.2,44.08 v56.2,42.3
  Bottom 0.5: v54.7,67.6 55.25,67.06 v55.25,64.4 | v65.2,68 71.65,68 U$1.P$1
  Bottom 0.6: v3.9,68.3 2.3,69.9 v2.3,75.8 | v10.42,64 14.9,68.48 v14.9,68.8
  pour Top (no thermals): 26.41,24.2 29.49,24.2 30.14,23.55 30.14,21.41 34.9,21.41 34.9,17.5 30.9,17.5 29.11,19.29 29.11,23.29 28.62,23.78 26.41,23.78
  pour Top (no thermals): 32.64,13.5 32.64,9 35.9,9 35.9,13.5
  pour Top (no thermals): 22.4,24.13 19.03,24.13 18.53,23.63 18.53,21.65 13.9,21.65 13.9,17.5 17.9,17.5 19.39,18.99 19.39,23.17 20.04,23.82 22.4,23.82
  pour Top (no thermals): 22.71,20.9 20.9,20.9 20.9,20 26.06,20 26.06,30 22.71,30
  pour Top (no thermals): 22.38,54.88 19.49,54.88 18.62,55.75 18.62,57.62 13.89,57.62 13.89,61.53 17.89,61.53 19.68,59.74 19.68,55.74 20.17,55.25 22.38,55.25
  pour Top (no thermals): 16.13,65.53 16.13,70.03 12.89,70.03 12.89,65.53
  pour Top (no thermals): 26.39,54.86 29.76,54.86 30.26,55.36 30.26,57.53 34.89,57.53 34.89,61.53 30.89,61.53 29.42,60.06 29.42,55.88 28.75,55.21 26.39,55.21
  pour Top (no thermals): 26.09,58 27.9,58 27.9,59 22.74,59 22.74,49 26.09,49
  pour Bottom (isolate 0.3, rank 2, no thermals): 82,71.2 0,71.2 0,0.1 82,0.1
GND-OUT
  Top 0.4: U$12.P$3 36,5.9
  Top 0.5: JP1.12 JP1.11
  Top 0.6: 36,5.9 36.5,5.4 38,5.4 | 38,5.4 40,5.4 | U$12.P$7 40,5.4 | U$12.P$5 38,5.4 | 40,5.4 42,5.4 | U$1.P$2 81.35,74.15 81.35,6.65 79.67,6.65 79.52,6.5 79.35,6.5 79.35,0.65 46.75,0.65 42,5.4 | U$12.P$9 42,5.4
  Bottom 0.5: U$1.P$2 79.45,74.15 79.5,74.2 79.5,78.3 69.1,88.7 49.87,88.7 JP1.12
  pour Bottom (isolate 0.3, rank 2, no thermals): 82,92 0,92 0,71.6 82,71.6
INA_BMS+  (via drill 0.35 pad 0.7)
  Top 0.4: U$23.19 20.13,55.68 v19.92,55.89
  Top 0.8: R75.1 43,67.7 46.1,67.7 46.85,68.45 R77.1 | C47.P$1 12.9,22.35 12.9,12.9 13,12.9 VR-FB.1
  Top 2: C47.P$1 14.45,25.35 12,27.8 12,53.6 | 12,53.6 12.05,53.65 C55.P$1 | R75.1 33.3,68.5 24.7,77.1 13.8,77.1 10.5,73.8 10.5,70.2 12,68.7 12,53.6
  Bottom 0.4: v19.92,55.89 18.13,54.1 v17.2,54.1
  other vias: 17.19,26.02 17.2,53
  pour Top (no thermals): 22.32,26.11 22.32,25.27 18.23,25.27 16.37,23.41 14.97,23.41 14.97,27.36 16.54,27.36 17.79,26.11
  pour Top (no thermals): 22.29,52.9 17.76,52.9 16.59,51.73 14.99,51.73 14.99,55.43 16.63,55.43 18.31,53.75 22.29,53.75
  pour Bottom (no thermals): 14.9,23.4 17.8,23.4 17.8,27.4 14.9,27.4
  pour Bottom (no thermals): 14.9,51.4 17.8,51.4 17.8,55.4 14.9,55.4
INA_BUS+  (via drill 0.35, 0.35 pad 0.7)
  Top 0.4: v35.6,21.3 36.15,21.3 R65.2 | U$59.19 28.8,23.33 v28.9,23.43
  Top 0.6: 31.5,53.73 v31.5,53
  Top 0.8: R71.1 57.9,75.5 56.35,75.5 54.65,73.8 R74.1 | VR-RUN.1 37.25,40.85 37.4,40.7 | R1.1 24.2,74.8 32.7,66.3 32.7,64.7 40.55,56.85
  Top 2: C48.P$1 37.4,29.85 37.4,40.7 37.4,53.7 | 37.4,53.7 32.95,53.7 C54.P$1 | R71.1 61.5,74.1 62.8,72.8 62.8,67.8 61,66 49.7,66 40.55,56.85 37.4,53.7
  Bottom 0.4: v35.6,21.3 32.2,24.7 v31.6,24.7 30.33,23.43 v28.9,23.43
  Bottom 0.6: v31.5,53 v31.5,54
  pour Top (no thermals): 26.5,26.12 31.02,26.12 32.2,27.3 33.8,27.3 33.8,23.6 32.1,23.6 30.42,25.28 26.5,25.28
  pour Top (no thermals): 26.8,52.92 26.8,53.85 30.57,53.85 32.32,55.6 33.76,55.6 33.76,51.77 32.15,51.77 31,52.92
  pour Bottom (no thermals): 33.8,23.6 33.8,27.3 31.1,27.3 31.1,23.6
  pour Bottom (no thermals): 33.8,51.9 33.8,55.6 31.1,55.6 31.1,51.9
N$1
  Top 0.3: IC2.5 63.9,33.45 64.05,33.6 C1.1
N$2
  Top 0.3: R7.2 3.15,63.4 R4.2
  Top 0.4: R4.2 R5.2 5.2,67.95 5.2,70.95 4.15,72 OPA.P$3
N$3
  Top 0.3: AD5272#2.2 17.39,72.7 17.18,72.91 17.18,73.67 | R1.2 17.18,73.67 | U$23.12 27.27,57.05 28.1,57.05 28.9,57.85 28.9,66.9 26.3,69.5 20.66,69.5 19.66,70.5 19.66,73.2 19.16,73.7 17.39,73.7 17.36,73.67 17.18,73.67
N$4
  Top 0.3: C1.2 68.9,34.35 70.75,34.35 71.47,33.62 TCXO.P$3
N$14
  Top 0.3: INA219#1.2 53.2,69.25 53.75,69.81 53.75,71.94 54.05,72.25 56.3,72.25 56.35,72.3 | C9.2 56.35,72.3 | 56.35,72.3 R74.2
N$17
  Top 0.3: R81.2 58,21.75 PB5.C
N$48
  Top 0.3: AD5272#2.3 AD5272#2.4 16.65,71.7 R3.1 15.5,71.15 C29.2
N$51
  Top 0.3: C29.1 14.55,71.15 15.4,70.3 17.27,70.3 AD5272#2.5
N$77
  Top 0.3: U$23.21 21.73,54.3 22.32,54.3 22.52,54.1 22.52,52.71 22.25,52.43 U$23.24
  pour Top (no thermals): 18.46,54.13 22.19,54.13 22.19,54.49 19.35,54.49 18.23,55.61 18.23,57.19 18.2,57.22 13.58,57.22 12.89,56.53 12.89,40.53 23.89,40.53 23.89,46.53 15.39,46.53 15.39,50.73 19.89,50.73 19.89,52.03 22.29,52.03 22.29,52.52 17.93,52.52 17.93,51.35 14.61,51.35 14.61,55.82 16.77,55.82
N$78
  Top 0.3: U$23.8 27.12,54.3 26.53,54.3 26.3,54.08 26.3,52.73 26.61,52.43 U$23.5
  pour Top (no thermals): 24.89,46.53 24.89,40.53 35.89,40.53 35.89,56.03 34.89,57.03 30.89,57.03 30.66,56.8 30.66,55.23 29.91,54.48 26.51,54.48 26.51,54.23 30.41,54.23 32.17,55.99 34.18,55.99 34.18,51.35 30.85,51.35 30.85,52.53 26.51,52.53 26.51,52.13 28.89,52.13 28.89,50.26 33.39,50.26 33.39,46.53
N$79
  Top 0.4: U$23.17 20.93,56.98 19.9,58.01 19.9,60.35 R28.2
N$80
  Top 0.4: C49.2 20.52,50 20.64,50.12 20.64,50.98 20.79,51.13 U$23.26
N$81
  Top 0.4: U$23.13 27.9,57.63 28.15,57.88 28.15,61.8 R30.1
N$82
  Top 0.4: C52.1 R30.2
N$84
  Top 0.4: C50.2 28.83,49.5 28.15,50.18 28.15,50.89 27.91,51.13 U$23.3
N$85
  Top 0.4: R32.2 8.25,54.6 LED_R1.A
N$87
  Top 0.4: R57.2 7.75,24.9 LED_R2.A
N$89
  Top 0.3: 16.75,15.6 16.6,15.45 VR-FB.2
  Top 0.4: U$59.12 20.64,22.03 19.24,20.63 19.24,18.09 16.75,15.6
N$91
  Top 0.3: LED_G1.C 9.35,18.9 R100.2
N$92
  Top 0.3: LED_G2.C 9.85,60.6 R33.2
N$129
  Top 0.4: C41.2 19.98,29.5 20.64,28.84 20.64,28.08 20.84,27.88 U$59.3
N$131
  Top 0.3: U$59.24 27.07,26.5 26.48,26.5 26.27,26.3 26.27,24.91 26.55,24.63 U$59.21
  pour Top (no thermals): 30.25,24.9 26.5,24.9 26.5,24.58 29.67,24.58 30.53,23.72 30.53,21.87 30.59,21.81 35.21,21.81 35.9,22.5 35.9,39 24.9,39 24.9,33 33.4,33 33.4,28.72 28.9,28.72 28.9,27 26.5,27 26.5,26.51 30.84,26.51 30.84,27.69 34.19,27.69 34.19,23.22 31.93,23.22
N$132
  Top 0.3: U$59.8 21.68,24.7 22.27,24.7 22.5,24.93 22.5,26.27 22.2,26.58 U$59.5
  pour Top (no thermals): 23.83,33 23.83,39 12.83,39 12.83,23 13.8,22.03 17.86,22.03 18.07,22.24 18.07,23.77 18.81,24.51 22.28,24.51 22.28,24.87 18.38,24.87 16.53,23.02 14.5,23.02 14.5,27.75 17.97,27.75 17.97,26.5 22.33,26.5 22.33,27 19.83,27 19.83,28.77 15.33,28.77 15.33,33
N$135  (via drill 0.35)
  Top 0.4: U$59.13 20.88,21.38 20.51,21.01 20.51,20.52 20.09,20.1 v20.09,18.92 | v21.39,17.95 21.39,15.14 R69.1
  Bottom 0.4: v20.09,18.92 20.35,18.92 21.32,17.95 v21.39,17.95
N$136
  Top 0.4: C44.1 R69.2
N$139
  Top 0.4: C46.1 R66.1
N$142
  Top 0.4: U$59.17 28.09,22.03 29.72,20.4 29.72,17.83 R68.2
N$144
  Top 0.4: C40.2 28.77,29.5 28.15,28.88 28.15,28.12 27.91,27.88 U$59.26
N$147
  Top 0.3: INA219#1.1 54.25,68.6 R73.2 C9.1
N$150
  Top 0.3: INA219#2.1 47.3,74.05 R76.2 C10.1
N$151
  Top 0.3: 45.2,70.3 47.4,70.3 47.75,70.66 47.75,72.84 48.3,73.4 INA219#2.2 | C10.2 45.2,71.25 45.2,70.3 | 45.2,70.3 45.2,69.05 R77.2
N$159
  Top 0.3: PWR.C 74.15,25.4 R82.2
N$161
  Top 0.3: IC2.41 58.15,29.2 57.8,28.86 R81.1
N$215  (via drill 0.35, 0.35 pad 0.7)
  Top 0.25: LED_G2.A 10.42,59.67 v10.42,60.07 | 17.9,67.1 18,67 v19.5,67 C57.1
  Top 0.3: U$23.15 U$23.16 | AD5272#2.1 18.95,73.2 19.16,73 19.16,68.36 17.9,67.1 C53.1
  Top 0.4: U$23.11 28.4,56.33 28.62,56.55 28.91,56.55 v29.26,56.9 | v25.3,59.5 22.5,59.5 | 22.5,59.5 22.5,61.45 C56.1 22.5,61.55 C57.1 | 22.5,59.5 21.65,58.65 U$23.15
  Bottom 0.25: v10.42,60.07 17.35,67 v19.5,67
  Bottom 0.4: v29.26,56.9 26.66,59.5 v25.3,59.5
  pour Top (no thermals): 22.29,57.28 20.25,57.28 20.25,63.17 17.89,65.53 16.55,65.53 16.55,68.53 19.89,68.53 20.89,67.53 20.89,58.42 22.29,58.42
N$234  (via drill 0.35, 0.35 pad 0.7)
  Top 0.3: v22.13,19.3 22.43,19.6 26.2,19.6 26.8,19 27,19 | LED_G1.A 11.87,20.5 v11.92,20.44 | C45.1 28.1,14.9 28.1,19.7
  Top 0.4: U$59.11 20.7,22.68 20.68,22.66 20.35,22.66 19.91,22.22 v19.6,22.22 | 27,19 27.4,19 28.1,19.7 28.1,21.14 27.86,21.38 U$59.16
  Bottom 0.3: v11.92,20.44 17.54,20.44 20.76,17.23 22.31,17.23 23.13,18.04 23.13,18.64 22.7,19.07 22.36,19.07 v22.13,19.3
  Bottom 0.4: v19.6,22.22 19.6,21.83 v22.13,19.3
  pour Top (no thermals): 26.5,21.75 28.2,21.7 28.73,21.17 28.73,19.07 29.56,18.09 29.56,15.14 31.2,13.5 32.24,13.5 32.24,10.5 28.9,10.5 27.9,11.5 27.9,21.11 26.5,21.11
NRST
  Top 0.3: IC2.7 67.3,34.45 R79.2 68.75,35.75 69.5,35 75.3,35 76.8,33.5 76.8,20.4 64.2,7.8 44.7,7.8 44.05,7.14 44.05,6.7 U$12.P$11
PGOOD1  (via drill 0.35, 0.4)
  Top 0.3: v21.6,30.5 23.6,32.5 v32.8,32.5 | IC2.19 58.65,41.45 60.68,43.48 60.68,46.88 59.76,47.8 57.32,47.8 56.95,48.17 v56.63,48.17 | v11.9,22.5 LED_R2.C
  Top 0.4: U$59.10 19.82,23.33 v19.77,23.29
  Bottom 0.3: v11.9,22.5 12.69,23.29 v19.77,23.29 19.77,28.67 v21.6,30.5 | v32.8,32.5 48.47,48.17 v56.63,48.17
PGOOD2  (via drill 0.35, 0.35 pad 0.7)
  Top 0.25: v29.2,48.7 28,47.5 v17.1,47.5 | v9.1,47.5 9.03,47.5 9.03,56.27 LED_R1.C
  Top 0.3: IC2.18 59.15,41.24 61.2,43.29 61.2,47.06 59.96,48.3 57.53,48.3 v56.63,49.2
  Top 0.4: U$23.10 29.11,55.68 v29.17,55.74
  Bottom 0.25: v29.17,55.74 29.17,48.77 29.2,48.77 | 29.2,48.77 v29.2,48.7 | v17.1,47.5 v9.1,47.5 | v56.63,49.2 56.2,48.77 29.2,48.77
RUN  (via drill 0.35)
  Top 0.3: VR-RUN.2 v13.7,39.7 | v4.3,74.6 OPA.P$4
  Bottom 0.3: v13.7,39.7 7.2,46.2 7.2,71.7 v4.3,74.6
RX-S  (via drill 0.35)
  Top 0.3: IC2.31 51.95,33.95 51.8,34.1 47.7,34.1 46.3,32.7 46.3,13.86 v46.02,13.58 | v45,14.8 45,14.5 38.3,7.8 37.6,7.8 37.05,7.25 37.05,6.7 U$12.P$4
  Bottom 0.3: v46.02,13.58 46.02,13.78 v45,14.8
SCL  (via drill 0.35)
  Top 0.3: IC2.21 57.65,42.3 R101.2 58.55,44.9 56.41,44.9 55.9,45.41 55.9,51.14 47.84,59.2 v47.84,59.4 | INA219#2.5 50.85,72.1 INA219#1.5 49.2,70.45 48.65,70.45 47.98,69.78 47.98,67.45 v48.38,67.05 | AD5272#2.9 24.92,72.7 v27.01,70.61
  Bottom 0.3: v48.38,67.05 51.33,64.09 51.33,62.89 v47.84,59.4 47.6,59.4 36.39,70.61 v27.01,70.61
SCLTM  (via drill 0.35)
  Top 0.3: IC2.45 60.15,28.82 59.84,28.51 59.84,25.61 60.88,24.58 65.55,24.58 v66.44,25.47 | v56.27,61.72 56.28,61.71 56.28,60.81 56.71,60.38 57.03,60.38 66.51,50.91 66.51,39.71 66.4,39.6 v66.3,39.6
  Bottom 0.3: JP1.13 47.85,81.1 56.5,72.45 56.5,61.95 v56.27,61.72 | v66.3,39.6 66.3,38.2 67.63,36.87 67.63,26.66 v66.44,25.47
SDA  (via drill 0.35)
  Top 0.3: IC2.22 57.15,44 | 57.15,44 R102.2 | INA219#2.6 52.45,72.75 52.7,72.5 52.7,71.75 52.45,71.5 51.41,71.5 49.8,69.9 INA219#1.6 49.2,69.8 48.7,69.8 48.5,69.59 48.5,68.25 49.09,67.67 v50.23,67.67 | v47.8,57.27 48.16,57.27 54.8,50.64 54.8,44.45 55.29,43.96 55.89,43.96 55.93,44 57.15,44 | AD5272#2.8 24.39,72.2 v25.74,70.84
  Bottom 0.3: v50.23,67.67 50.23,66.79 52.43,64.59 52.43,62 47.8,57.37 v47.8,57.27 47.39,57.68 47.3,57.68 46.88,58.11 46.88,59.32 36.32,69.88 26.71,69.88 v25.74,70.84
SDATM  (via drill 0.35)
  Top 0.3: IC2.46 60.65,28.58 60.4,28.32 60.4,25.8 60.79,25.41 65.15,25.41 v65.25,25.31 | v56.79,59.59 57.12,59.59 65.81,50.9 65.81,40.46 v65.78,40.43
  Bottom 0.3: JP1.14 46.18,82.47 46.18,80.66 47.17,79.67 48.57,79.67 56,72.24 56,62.48 55.54,62.03 55.54,60.84 v56.79,59.59 | v65.78,40.43 65.78,40.11 65.57,39.9 65.57,38.22 67.13,36.66 67.13,27.16 66.41,26.45 66.39,26.45 v65.25,25.31
SWC
  Top 0.3: IC2.37 56.15,23.9 R27.2 55.95,23.25 56.6,22.6 56.6,18.3 46.6,8.3 44.2,8.3 43.05,7.14 43.05,6.7 U$12.P$10
SWD
  Top 0.3: IC2.34 50.5,32.45 R64.2 50.09,32.7 49.2,33.6 47.91,33.6 46.8,32.49 46.8,13.29 41.05,7.54 41.05,6.7 U$12.P$8
TIME  (via drill 0.35)
  Top 0.3: IC2.42 58.65,25.44 60.01,24.08 66.08,24.08 v67.4,25.4 | v57.01,61.11 67.03,51.1 v67.03,38.9
  Bottom 0.3: v67.4,25.4 68.13,26.13 68.13,37.1 67.03,38.2 v67.03,38.9 | v57.01,61.11 57,61.12 57,72.68 49.89,79.79 JP1.15
TX-S
  Top 0.3: IC2.30 52.16,34.45 52.01,34.6 47.4,34.6 45.8,33 45.8,14.49 39.05,7.75 39.05,6.7 U$12.P$6
Y  (via drill 0.35)
  Top 0.3: v22.4,18.34 22.56,18.5 26.72,18.5 27.07,18.15 v27.15,18.15 | v29.1,22.4 28.82,22.68 U$59.18 | v3.9,69.8 3.7,70 INVERT.P$4 | R57.1 9.35,23.89 8.5,23.05 8.5,21.95 9.05,21.4 v11.9,21.4
  Bottom 0.3: v11.9,21.4 12,21.4 | 12,21.4 19,21.4 22.06,18.34 v22.4,18.34 | v27.15,18.15 29.1,20.1 v29.1,22.4 | 12,21.4 11.63,21.77 11.6,21.77 11.17,22.2 11.17,41.52 6.7,45.99 6.7,67 v3.9,69.8

### Text on the board
tNames: ON | ERR | DISCHARGE / DC-DC | BMS+ | CHARGE / DC-DC | ERR | ON